# EAGLE design 2x20 breakout (EAGLE 6.5.0)
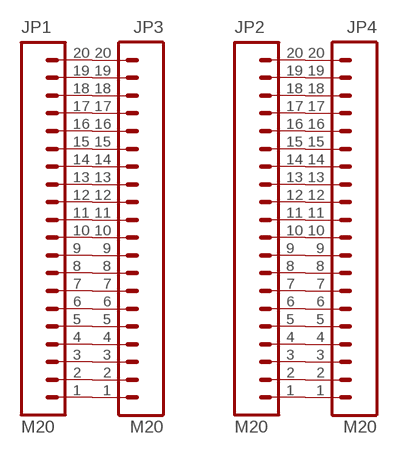
[diagram p0: schematic, sheet 1]

## Parts
JP1  M20  [1X20]
JP2  M20  [1X20]
JP3  M20  [1X20]
JP4  M20  [1X20]

## Nets
N$1: JP2.1 JP4.1
N$2: JP2.2 JP4.2
N$3: JP2.3 JP4.3
N$4: JP2.4 JP4.4
N$5: JP2.5 JP4.5
N$6: JP2.6 JP4.6
N$7: JP2.7 JP4.7
N$8: JP2.8 JP4.8
N$9: JP2.9 JP4.9
N$10: JP2.10 JP4.10
N$11: JP2.11 JP4.11
N$12: JP2.12 JP4.12
N$13: JP2.13 JP4.13
N$14: JP2.14 JP4.14
N$15: JP2.15 JP4.15
N$16: JP2.16 JP4.16
N$17: JP2.17 JP4.17
N$18: JP2.18 JP4.18
N$19: JP2.19 JP4.19
N$20: JP2.20 JP4.20
N$21: JP1.1 JP3.1
N$22: JP1.2 JP3.2
N$23: JP1.3 JP3.3
N$24: JP1.4 JP3.4
N$25: JP1.5 JP3.5
N$26: JP1.6 JP3.6
N$27: JP1.7 JP3.7
N$28: JP1.8 JP3.8
N$29: JP1.9 JP3.9
N$30: JP1.10 JP3.10
N$31: JP1.11 JP3.11
N$32: JP1.12 JP3.12
N$33: JP1.13 JP3.13
N$34: JP1.14 JP3.14
N$35: JP1.15 JP3.15
N$36: JP1.16 JP3.16
N$37: JP1.17 JP3.17
N$38: JP1.18 JP3.18
N$39: JP1.19 JP3.19
N$40: JP1.20 JP3.20

## Library data of the parts
JP1-JP4 = SparkFun-Connectors:M20: 1x20 .1" header This is just like the LOCK variant in that the holes are staggared by 5 mil, but except for the last two holes. They are not altered from the "standard" footprint layout. This is used for a special purpose on the layout of our Graphic LCD Backpack. Make sure you want to use this device before selecting it for you project!

## Board
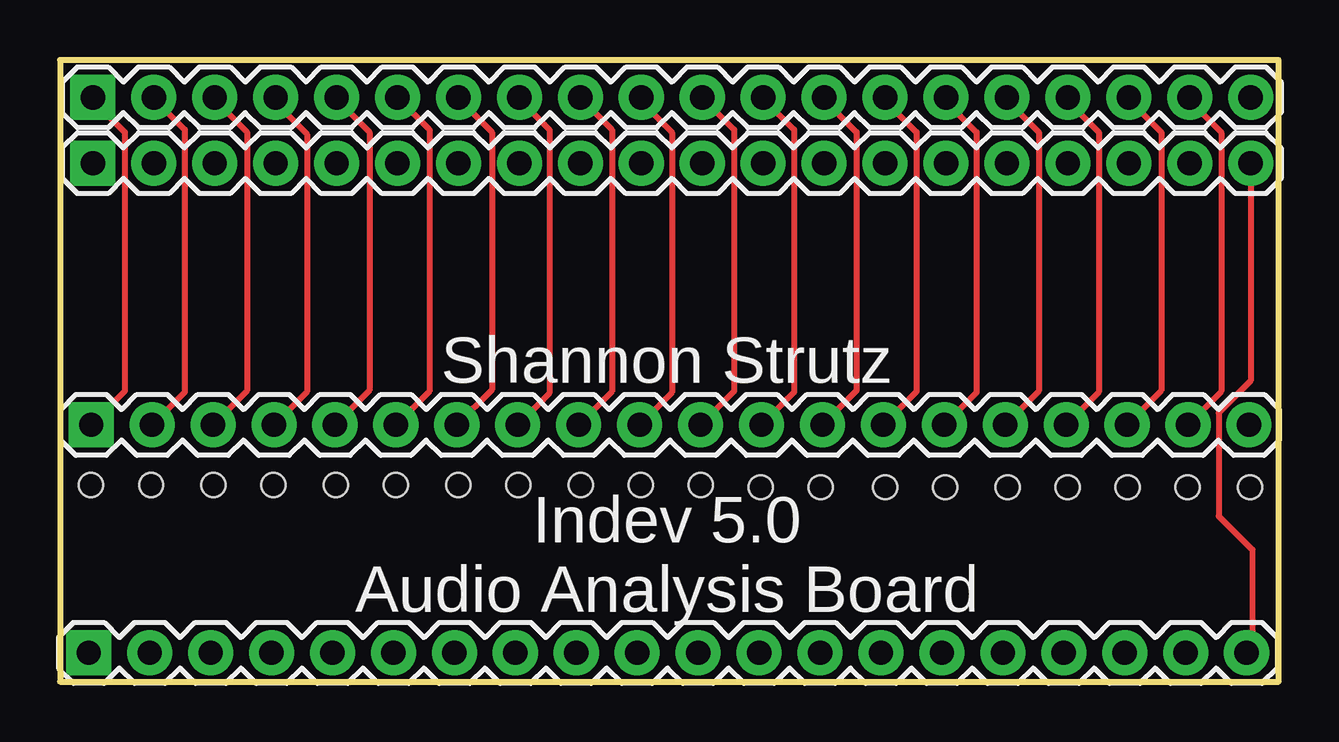
[diagram p1: board, top side]
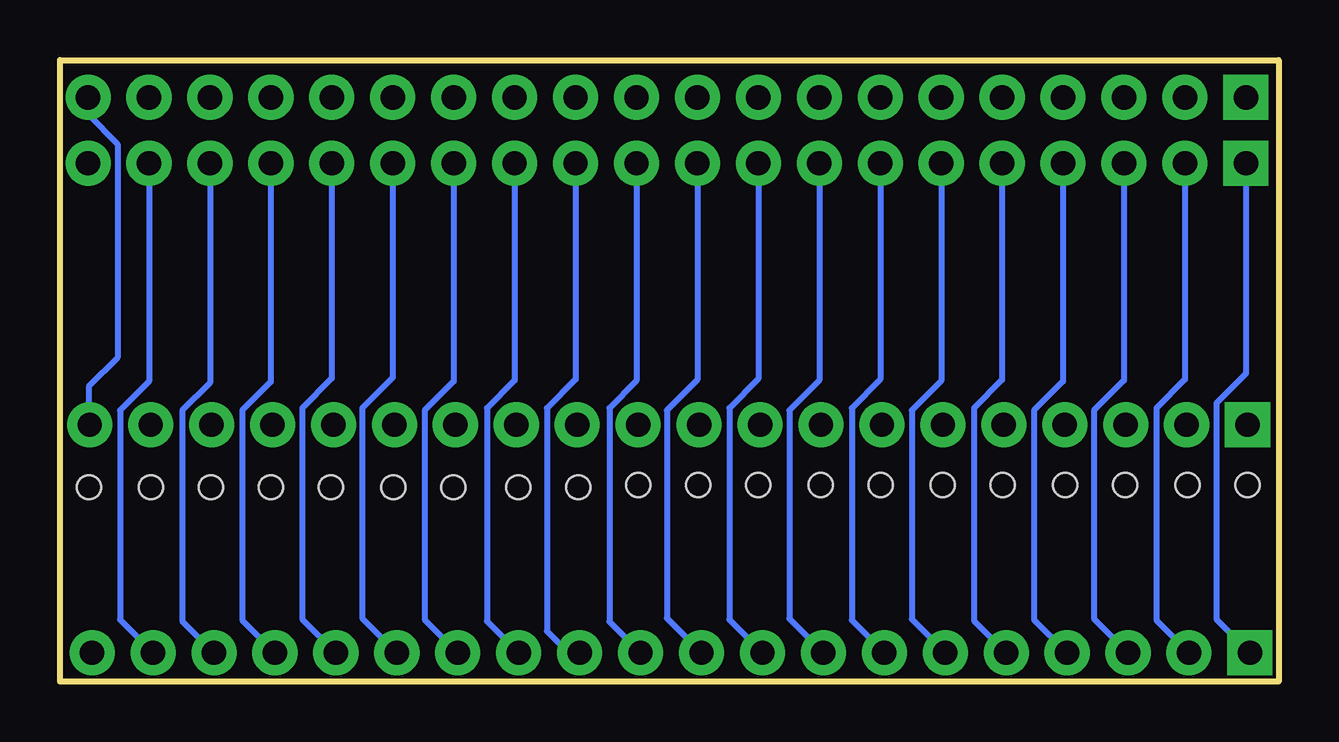
[diagram p2: board, bottom side, seen from below]

Size 50.8 x 25.9 mm. Coordinates in mm from the lower left corner, seen from the top.
Outline: 0,0 50.8,0 50.8,25.9 0,25.9 0,0
Copper layers (1*16): Top 0.035mm / dielectric 1.5mm / Bottom 0.035mm
Design rules "default": minimum track width 10mil, minimum drill 24mil, track to track 8mil, track to pad 8mil, pad to pad 8mil, via to via 8mil, smd to smd 8mil, copper to edge 40mil, drill to drill 8mil, minimum pad ring 10mil, minimum via ring 8mil, stop-mask expansion 4mil, vias tented up to drill 0mil, thermal gap 10mil
Holes 1 mm at 1.3,8.2 3.8,8.2 6.4,8.2 8.9,8.2 11.5,8.2 14,8.2 16.6,8.2 19.1,8.2 21.7,8.2 24.2,8.2 26.7,8.2 29.2,8.1 31.7,8.1 34.4,8.1 36.9,8.1 39.5,8.1 42,8.1 44.5,8.1 47,8.1 49.6,8.1

### Footprints (pad centres in the part's own frame; a part is rotated, then mirrored left to right if it is on the bottom)
1X20 = drill 1.016 pad 1.88 square: 1 0,0 | drill 1.016 pad 1.88: 2 2.54,0; 3 5.08,0; 4 7.62,0; 5 10.16,0; 6 12.7,0; 7 15.24,0; 8 17.78,0; 9 20.32,0; 10 22.86,0; 11 25.4,0; 12 27.94,0; 13 30.48,0; 14 33.02,0; 15 35.56,0; 16 38.1,0; 17 40.64,0; 18 43.18,0; 19 45.72,0; 20 48.26,0

### Placement (x,y rotation side)
JP1  1.3,10.7 0 top
JP2  1.37,21.6 0 top
JP3  1.37,24.34 0 top
JP4  1.2,1.2 0 top

### Tracks (layer width: path | path; a pad name or v marks a point on that pad's centre or on a via)
N$1
  Bottom 0.254: JP2.1 1.37,12.83 2.6,11.6 2.6,2.6 JP4.1
N$2
  Bottom 0.254: JP2.2 3.91,12.59 5.1,11.4 5.1,2.56 JP4.2
N$3
  Bottom 0.254: JP2.3 6.45,12.55 7.7,11.3 7.7,2.62 JP4.3
N$4
  Bottom 0.254: JP2.4 8.99,12.51 10.2,11.3 10.2,2.58 JP4.4
N$5
  Bottom 0.254: JP2.5 11.53,12.57 12.7,11.4 12.7,2.54 JP4.5
N$6
  Bottom 0.254: JP2.6 14.07,12.53 15.3,11.3 15.3,2.6 JP4.6
N$7
  Bottom 0.254: JP2.7 16.61,12.59 17.8,11.4 17.8,2.56 JP4.7
N$8
  Bottom 0.254: JP2.8 19.15,12.55 20.4,11.3 20.4,2.62 JP4.8
N$9
  Bottom 0.254: JP2.9 21.69,12.61 22.9,11.4 22.9,2.58 JP4.9
  Bottom 0.406: JP4.9 21.59,1.2
N$10
  Bottom 0.254: JP2.10 24.23,12.57 25.5,11.3 25.5,2.64 JP4.10
  Bottom 0.406: JP4.10 24.13,1.2
N$11
  Bottom 0.254: JP2.11 26.77,12.53 27.9,11.4 27.9,2.5 JP4.11
N$12
  Bottom 0.254: JP2.12 29.31,12.59 30.5,11.4 30.5,2.1 29.1,0.7 29.1,1.16 JP4.12
N$13
  Bottom 0.254: JP2.13 31.85,12.55 33,11.4 33,2.52 JP4.13
N$14
  Bottom 0.254: JP2.14 34.39,12.51 35.6,11.3 35.6,2.58 JP4.14
N$15
  Bottom 0.254: JP2.15 36.93,12.67 38.2,11.4 38.2,2.64 JP4.15
N$16
  Bottom 0.254: JP2.16 39.47,12.63 40.7,11.4 40.7,2.6 JP4.16
N$17
  Bottom 0.254: JP2.17 42.01,12.49 43.2,11.3 43.2,2.56 JP4.17
N$18
  Bottom 0.254: JP2.18 44.55,12.45 45.7,11.3 45.7,2.52 JP4.18
N$19
  Bottom 0.254: JP2.19 47.09,12.51 48.3,11.3 48.3,2.58 JP4.19
N$20
  Top 0.254: JP2.20 49.63,12.53 48.3,11.2 48.3,6.9 49.7,5.5 49.7,1.44 JP4.20
N$21
  Top 0.254: JP3.1 1.37,24.23 2.7,22.9 2.7,12.1 JP1.1
N$22
  Top 0.254: JP3.2 3.91,24.29 5.2,23 5.2,12.06 JP1.2
N$23
  Top 0.254: JP3.3 6.45,24.25 7.8,22.9 7.8,12.12 JP1.3
N$24
  Top 0.254: JP3.4 8.99,24.11 10.3,22.8 10.3,12.08 JP1.4
N$25
  Top 0.254: JP3.5 11.53,24.27 12.9,22.9 12.9,12.14 JP1.5
N$26
  Top 0.254: JP3.6 15.4,23 15.4,12.1 JP1.6
N$27
  Top 0.254: JP3.7 16.61,24.29 18,22.9 18,12.16 JP1.7
N$28
  Top 0.254: JP3.8 19.15,24.25 20.4,23 20.4,12.02 JP1.8
N$29
  Top 0.254: JP3.9 21.69,24.31 23,23 23,12.08 JP1.9
N$30
  Top 0.254: JP3.10 24.23,24.17 25.5,22.9 25.5,12.04 JP1.10
N$31
  Top 0.254: JP3.11 28.1,23 28.1,12.1 JP1.11
N$32
  Top 0.254: JP3.12 29.31,24.29 30.6,23 30.6,12.06 JP1.12
N$33
  Top 0.254: JP3.13 31.85,24.25 33.2,22.9 33.2,12.12 JP1.13
N$34
  Top 0.254: JP3.14 34.39,24.21 35.7,22.9 35.7,12.08 JP1.14
N$35
  Top 0.254: JP3.15 36.93,24.17 38.2,22.9 38.2,12.04 JP1.15
N$36
  Top 0.254: JP3.16 39.47,24.23 40.8,22.9 40.8,12.1 JP1.16
N$37
  Top 0.254: JP3.17 42.01,24.19 43.3,22.9 43.3,12.06 JP1.17
N$38
  Top 0.254: JP3.18 44.55,24.25 45.9,22.9 45.9,12.12 JP1.18
N$39
  Top 0.254: JP3.19 47.09,24.21 48.4,22.9 48.4,12.08 JP1.19
N$40
  Bottom 0.254: JP3.20 49.63,23.63 48.4,22.4 48.4,13.5 49.6,12.3 49.6,10.74 JP1.20

### Text on the board
_tsilk: Shannon Strutz | Indev 5.0 / Audio Analysis Board